# Altium schematic sheet PV_MCONTROL_IO.SchDoc
size A
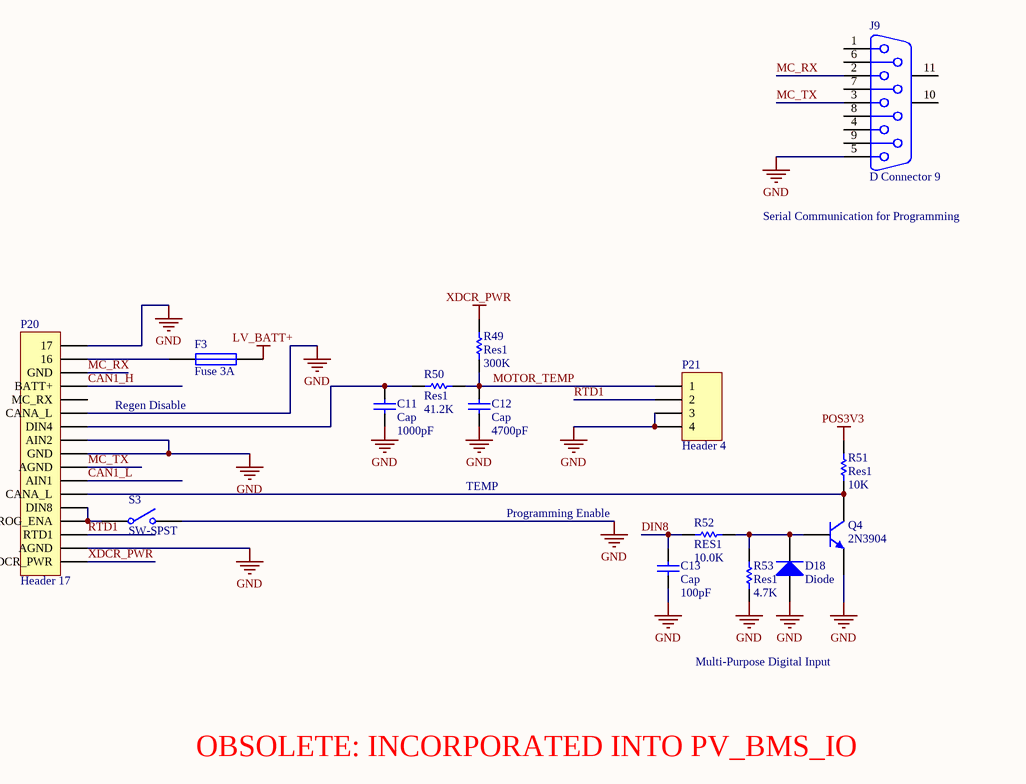
[diagram p0: PV_MCONTROL_IO.SchDoc]

## Parts
C11  Cap  value 1000pF  [RAD-0.3]
C12  Cap  value 4700pF  [RAD-0.3]
C13  Cap  value 100pF  [RAD-0.3]
D18  Diode  [SMC]
F3  Fuse 3A  [1A FUSE HOLDER]
J9  D Connector 9  [DSUB1.385-2H9]
P20  Header 17  [HDR1X17]
P21  Header 4  [HDR1X4]
Q4  2N3904  [TO-92A]
R49  Res1  value 300K  [AXIAL-0.3]
R50  Res1  value 41.2K  [AXIAL-0.3]
R51  Res1  value 10K  [AXIAL-0.3]
R52  RES1  value 10.0K  [AXIAL-0.3]
R53  Res1  value 4.7K  [AXIAL-0.3]
S3  SW-SPST  [SPST-2]

## Nets
GND: C11.1 C12.1 C13.1 D18.1(A) J9.5 P20.2(AGND) P20.9(GND) P20.10(AIN2) P20.12(CANA_L) P20.17 P21.3 P21.4 Q4.1(E) R53.1 S3.2(NO)
LV_BATT+: F3.2
POS3V3: R51.2
XDCR_PWR: P20.1(XDCR_PWR) R49.2
CAN1_H: P20.14(BATT+)
CAN1_L: P20.7(AIN1)
DIN8: C13.2 R52.1
MC_RX: J9.2 P20.15(GND)
MC_TX: J9.3 P20.8(AGND)
MOTOR_TEMP: C12.2 P21.1 R49.1 R50.1
RTD1: P20.3(RTD1) P21.2
NetC11_2: C11.2 P20.11(DIN4) R50.2
NetD18_2: D18.2(K) Q4.2(B) R52.2 R53.2
NetF3_1: F3.1 P20.16
NetP20_4: P20.4(/PROG_ENA) P20.5(DIN8) S3.1(COMMON)
NetP20_6: P20.6(CANA_L) Q4.3(C) R51.1

Not connected (* = marked no-connect by the designer): J9 1 4 6 7 8 9 10(MH1) 11(MH2); P20 13(MC_RX)

## Notes on the sheet
- Serial Communication for Programming
- Regen Disable
- TEMP
- Programming Enable
- Multi-Purpose Digital Input
- OBSOLETE: INCORPORATED INTO PV_BMS_IO

## Library data of the parts
C11-C13 = Cap: Capacitor; Published: 8-Jun-2000; LatestRevisionDate: 17-Jul-2002; LatestRevisionNote: Re-released for DXP Platform.; PackageReference: RAD-0.3; Publisher: Altium Limited; PackageDescription: Radial Cap, Thru-Hole; 2 Leads; 0.3 in Pin Spacing
D18 = Diode: Default Diode; Published: 8-Jun-2000; LatestRevisionDate: 17-Jul-2002; LatestRevisionNote: Re-released for DXP Platform.; PackageVersion: Sep-1996; PackageReference: SMC; Publisher: Altium Limited; PackageDescription: DO-214-AB/SMC; 2 C-Bend Leads; Body 7.9 x 5.9 mm, inc. leads (LxW); Code_JEDEC: DO-214-AB
F3 = Fuse 1: Fuse; Published: 8-Jun-2000; LatestRevisionDate: 17-Jul-2002; LatestRevisionNote: Re-released for DXP Platform.; PackageReference: PIN-W2/E2.8; Publisher: Altium Limited; PackageDescription: Thru-Hole; 2 Leads; ComponentLink1Description: Digikey- FUSE; ComponentLink1URL: https://www.digikey.com/product-detail/en/littelfuse-inc/0451001.MRL/F2577CT-ND/813055; ComponentLink2Description: Digikey - Holder; ComponentLink2URL: https://www.digikey.com/product-detail/en/littelfuse-inc/0154001.DR/F1222TR-ND/183352
J9 = D Connector 9: Receptacle Assembly, 9 Position, Right Angle; PackageDocument: O; Positions: 9; Published: 15-Jun-2001; LatestRevisionDate: 17-Jul-2002; LatestRevisionNote: Re-released for DXP Platform.; DatasheetDocument: 1-Sep-1999; PackageReference: 788750; Publisher: Altium Limited; Orientation: Right Angle; Gender: Receptacle
P20 = Header 17: Header, 17-Pin; LatestRevisionDate: 17-Jul-2002; LatestRevisionNote: Re-released for DXP Platform.; Publisher: Altium Limited
P21 = Header 4: Header, 4-Pin; LatestRevisionDate: 17-Jul-2002; LatestRevisionNote: Re-released for DXP Platform.; Publisher: Altium Limited
Q4 = 2N3904: NPN General Purpose Amplifier; Published: 8-Jun-2000; LatestRevisionDate: 15-Jan-2003; LatestRevisionNote: PCB Footprint 'BCY-W3/D4.7' replaced; DatasheetVersion: 1997; PackageVersion: Sep-1998; PackageReference: TO-92A; Publisher: Altium Limited; PackageDescription: TO, Flat Index; 3 In-Line, Axial Leads; Body Dia. 4.5mm; Leads 0.51 x 0.48 mm (max); ComponentLink1Description: Manufacturer Link; ComponentLink1URL: http://www.fairchildsemi.com/; ComponentLink2Description: Datasheet; ComponentLink2URL: http://www.fairchildsemi.com/ds/2N%2F2N3904.pdf
R49-R53 = Res1: Resistor; Published: 8-Jun-2000; LatestRevisionDate: 17-Jul-2002; LatestRevisionNote: Re-released for DXP Platform.; PackageReference: AXIAL-0.3; Publisher: Altium Limited; PackageDescription: Axial Device, Thru-Hole; 2 Leads; 0.3 in Pin Spacing
S3 = SW-SPST: Single-Pole, Single-Throw Switch; Published: 24-Mar-1999; LatestRevisionDate: 17-Jul-2002; LatestRevisionNote: Re-released for DXP Platform.; PackageReference: SPST-2; Publisher: Altium Limited; PackageDescription: Switch; 2 Leads